# Altium schematic sheet v1.1.SchDoc
size 101 x 26 mm
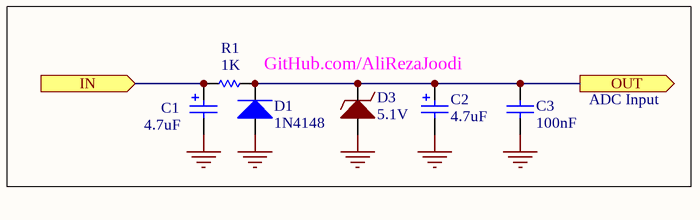
[diagram p0: v1.1.SchDoc]

## Parts
C1  4.7uF  [CAPPR2.5-6.3x5]
C2  4.7uF  [CAPPR2.5-6.3x5]
C3  100nF  [CAPNTO2.54-3.05x1.78A]
D1  1N4148  [D_THD_AXIAL0.4_DO-41]
D3  5.1V  [D_THD_AXIAL0.3_DO-35]
R1  1K  [R_THD_AXIAL0.4(1/4W)]

## Ports
IN (in), OUT (out)

## Nets
GND: C1.2 C2.2 C3.1 D1.1(A) D3.1
IN: C1.1 R1.1 ; port IN
OUT: C2.1 C3.2 D1.2(K) D3.2 R1.2 ; port OUT

## Notes on the sheet
- GitHub.com/AliRezaJoodi
- ADC Input

## Library data of the parts
C1 C2 = Cap Pol1: Polarized Capacitor (Radial); Manufacturer: Generic Components; Class I: Passive; Published: 8-Jun-2000; Revision: July-2002: Re-released for DXP Platform.; Publisher: Altium Limited; Class II: Capacitor
C3 = Cap: Capacitor; Manufacturer: Generic Components; Class I: Passive; Published: 8-Jun-2000; Revision: July-2002: Re-released for DXP Platform.; Publisher: Altium Limited; Class II: Capacitor
D1 = Diode: Diode,; Revision: July-2002: Re-released for DXP Platform.
D3 = Diode_Zener: Diode, Zener; Revision: July-2002: Re-released for DXP Platform.
R1 = Resistor: Revision: July-2002: Re-released for DXP Platform.